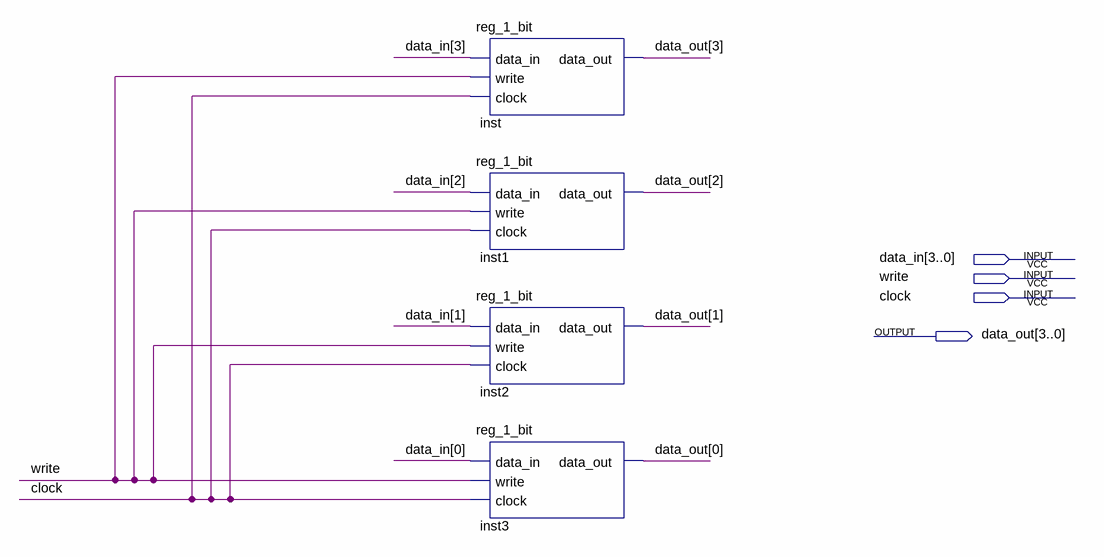
[diagram p0: schematic sheet]
// Quartus schematic reg_4_bits.bdf as structural Verilog: 4 symbols, 4 pins
module reg_4_bits (
  input  [3:0] data_in,
  input  write,
  input  clock,
  output [3:0] data_out
);

  reg_1_bit inst (.data_in(data_in[3]), .write(write), .clock(clock), .data_out(data_out[3]));
  reg_1_bit inst1 (.data_in(data_in[2]), .write(write), .clock(clock), .data_out(data_out[2]));
  reg_1_bit inst2 (.data_in(data_in[1]), .write(write), .clock(clock), .data_out(data_out[1]));
  reg_1_bit inst3 (.data_in(data_in[0]), .write(write), .clock(clock), .data_out(data_out[0]));
endmodule
